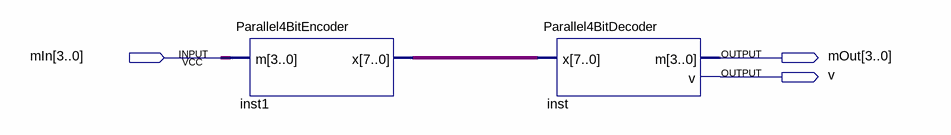
[diagram p0: schematic sheet]
// Quartus schematic parallelEncodeDecode.bdf as structural Verilog: 2 symbols, 3 pins
module parallelEncodeDecode (
  input  [3:0] mIn,
  output [3:0] mOut,
  output v
);

  wire [7:0] inst1_x;

  Parallel4BitEncoder inst1 (.m(mIn), .x(inst1_x));
  Parallel4BitDecoder inst (.x(inst1_x), .m(mOut), .v(v));
endmodule
